# EAGLE design uLI-00 (EAGLE 7.2.0)
AUTHOR: M. Petrilak; VERSION: 00
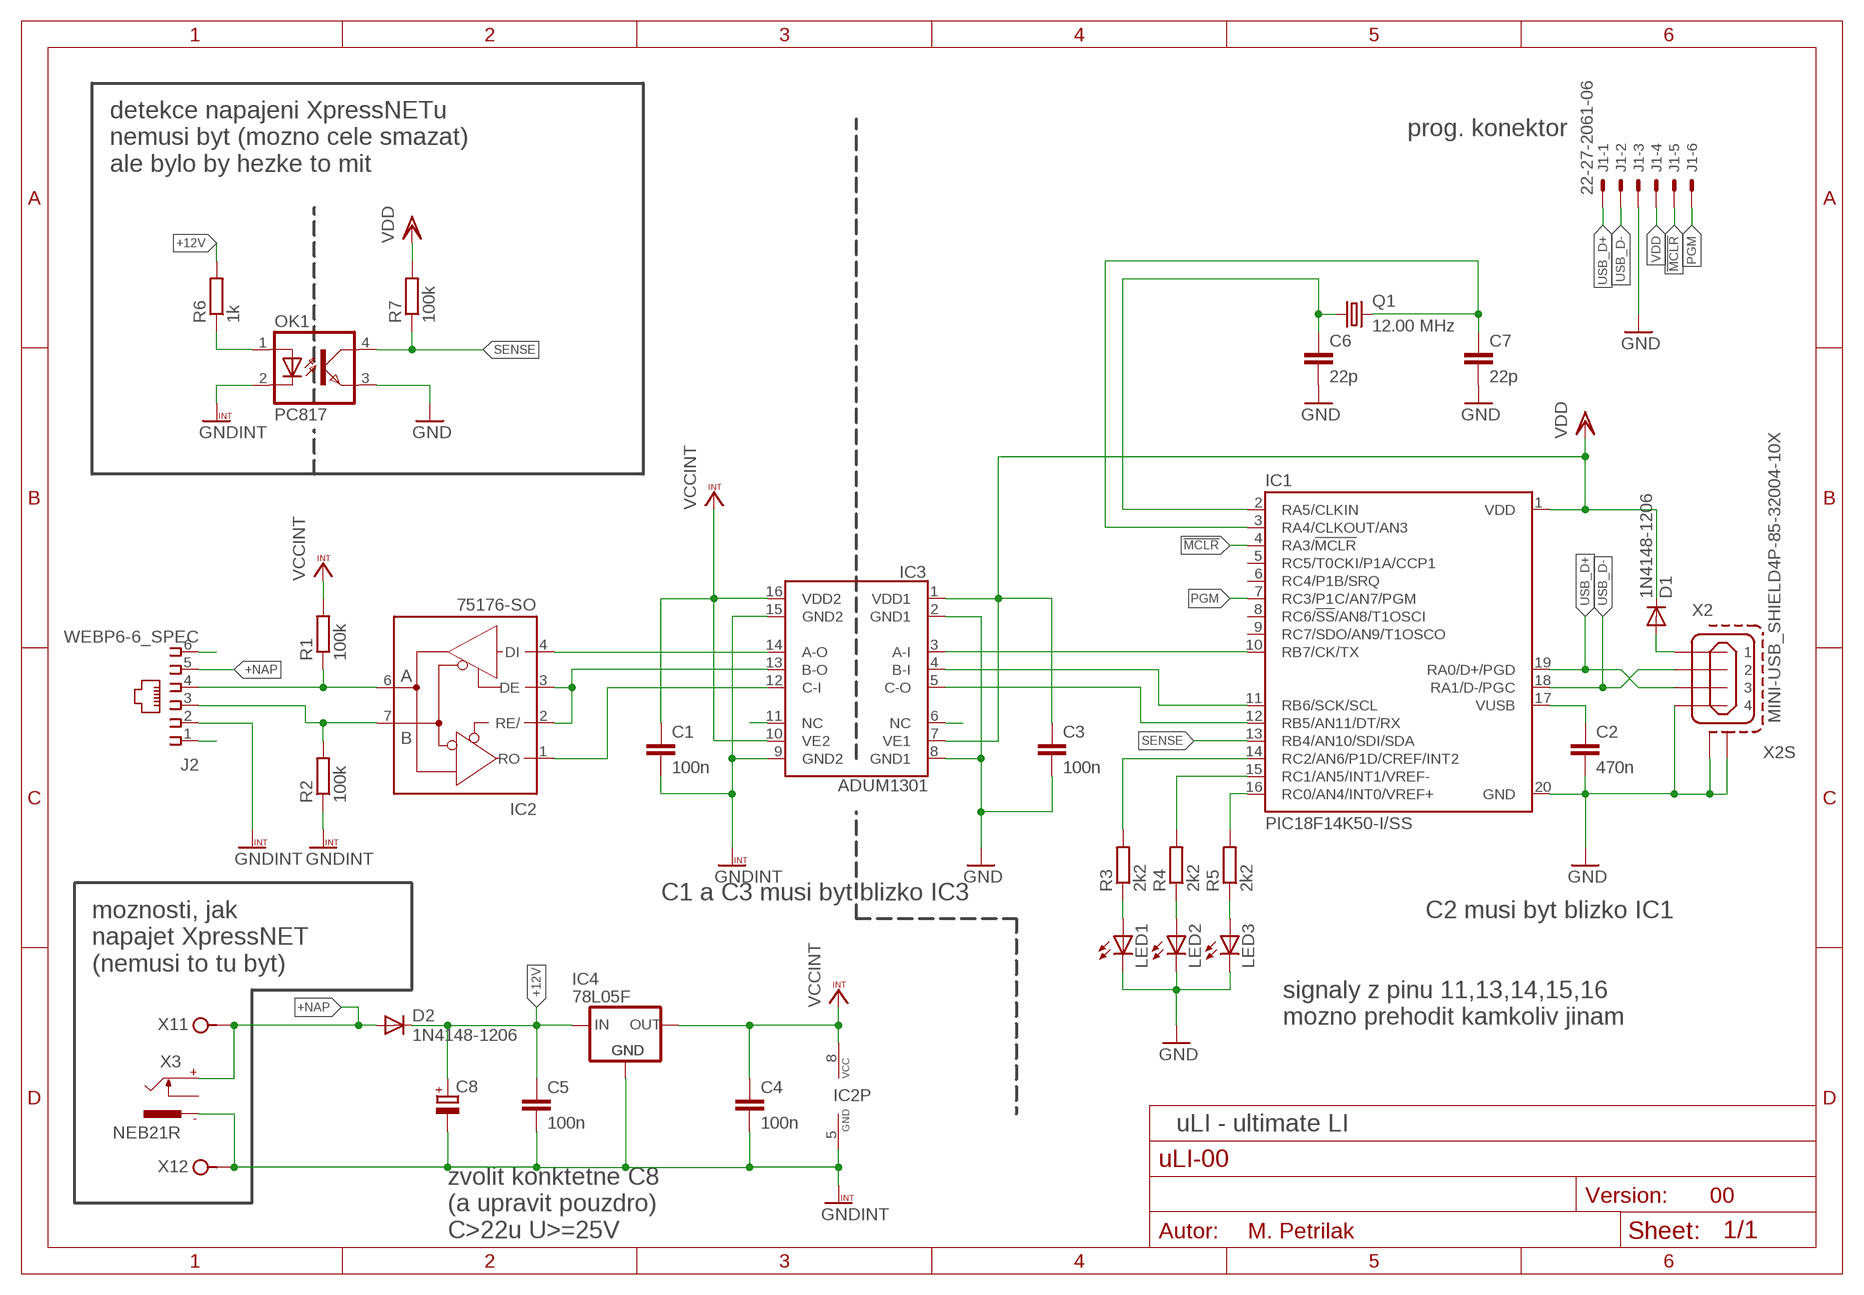
[diagram p0: schematic, sheet 1]

## Parts
C1  100n  C-EUC1206  [C1206]
C2  470n  C-EUC1206  [C1206]
C3  100n  C-EUC1206  [C1206]
C4  100n  C-EUC1206  [C1206]
C5  100n  C-EUC1206  [C1206]
C6  22p  C-EUC0805  [C0805]
C7  22p  C-EUC0805  [C0805]
C8  CPOL-EUE3.5-8L  [E3,5-8L]
D1  1N4148-1206  [D1206]
D2  1N4148-1206  [D1206]
IC1  PIC18F14K50-I/SS  [SSOP20]
IC2  75176-SO  [SO08]
IC3  ADUM1301  [SO-16W]
IC4  78L05F  [SOT89]
J1  22-27-2061-06  [6410-06]
J2  WEBP6-6_SPEC  [WEBP6-6_SPEC]
LED1  LED3MM  [LED3MM]
LED2  LED3MM  [LED3MM]
LED3  LED3MM  [LED3MM]
OK1  PC817  [DIL04]
Q1  12.00 MHz  XTAL  [HC49U70]
R1  100k  R-EU_R1206  [R1206]
R2  100k  R-EU_R1206  [R1206]
R3  2k2  R-EU_R1206  [R1206]
R4  2k2  R-EU_R1206  [R1206]
R5  2k2  R-EU_R1206  [R1206]
R6  1k  R-EU_R1206  [R1206]
R7  100k  R-EU_R1206  [R1206]
X1  ARK1550/2  [ARK1550/2]
X2  MINI-USB_SHIELD4P-85-32004-10X  [85-32004-10X]
X3  NEB21R  [NEB21R]

## Nets
!MCLR: IC1.4(RA3/!MCLR!) J1.5
+12V [BUS]: C5.1 C8.+ D2.C IC4.3(VI) R6.2
+NAP [BUS]: D2.A J2.5 X1.1 X3.+
BUS_A [BUS]: IC2.6(A) J2.4 R1.1
BUS_B [BUS]: IC2.7(B) J2.3 R2.2
GND: C2.2 C3.2 C6.2 C7.2 IC1.20(GND) IC3.2(GND1) IC3.8(GND1) J1.3 LED1.K(C) LED2.K(C) LED3.K(C) OK1.3(EMIT) X2.4 X2.M1(S1) X2.M2(S2)
GNDINT [BUS]: C1.2 C4.2 C5.2 C8.- IC2.5(GND) IC3.9(GND2) IC3.15(GND2) IC4.2(GND) IC4.2@1(GND) J2.2 OK1.2(C) R2.1 X1.2 X3.-
N$1: C2.1 IC1.17(VUSB)
N$2: LED1.A R3.1
N$3: LED2.A R4.1
N$4: IC1.12(RB5/AN11/DT/RX) IC3.5(C-O)
N$5: IC1.10(RB7/CK/TX) IC3.3(A-I)
N$6: IC1.11(RB6/SCK/SCL) IC3.4(B-I)
N$7 [BUS]: IC2.4(DI) IC3.14(A-O)
N$8: LED3.A R5.1
N$10: D1.A X2.1
N$11: IC1.14(RC2/AN6/P1D/CREF/INT2) R3.2
N$12: C7.1 IC1.3(RA4/CLKOUT/AN3) Q1.2
N$13 [BUS]: IC2.2(RE/) IC2.3(DE) IC3.13(B-O)
N$14 [BUS]: IC2.1(RO) IC3.12(C-I)
N$15: C6.1 IC1.2(RA5/CLKIN) Q1.1
N$16: IC1.15(RC1/AN5/INT1/VREF-) R4.2
N$17: IC1.16(RC0/AN4/INT0/VREF+) R5.2
N$19 [BUS]: J2.6
N$20 [BUS]: J2.1
N$21 [BUS]: IC3.11(NC)
N$22: IC3.6(NC)
N$23 [BUS]: OK1.1(A) R6.1
PGM: IC1.7(RC3/P1C/AN7/PGM) J1.6
SENSE: IC1.13(RB4/AN10/SDI/SDA) OK1.4(COL) R7.1
USB_D+: IC1.19(RA0/D+/PGD) J1.1 X2.3
USB_D-: IC1.18(RA1/D-/PGC) J1.2 X2.2
VCCINT [BUS]: C1.1 C4.1 IC2.8(VCC) IC3.10(VE2) IC3.16(VDD2) IC4.1(VO) R1.2
VDD: C3.1 D1.C IC1.1(VDD) IC3.1(VDD1) IC3.7(VE1) J1.4 R7.2
Unconnected: IC1.5(RC5/T0CKI/P1A/CCP1) IC1.6(RC4/P1B/SRQ) IC1.8(RC6/!SS!/AN8/T1OSCI) IC1.9(RC7/SDO/AN9/T1OSCO) X3.C

## Notes on the sheet
- detekce napajeni XpressNETu
  nemusi byt (mozno cele smazat)
  ale bylo by hezke to mit
- prog. konektor
- C1 a C3 musi byt blizko IC3
- C2 musi byt blizko IC1
- moznosti, jak
  napajet XpressNET
  (nemusi to tu byt)
- signaly z pinu 11,13,14,15,16
  mozno prehodit kamkoliv jinam
- uLI - ultimate LI
- zvolit konktetne C8
  (a upravit pouzdro)
  C>22u U>=25V

## Library data of the parts
C1-C7 = rcl:C-EU: CAPACITOR, European symbol
C8 = rcl:CPOL-EU: POLARIZED CAPACITOR, European symbol
D1 D2 = diode:1N4148: DIODE high speed (Philips)
IC1 = microchip:PIC18*K50: PIC with USB
IC2 = maxim:75176
IC3 = my:ADUM1301
IC4 = linear:78L*: POSITOIV-VOLTAGE REGULATORS Output up to 100 mA Source: http://focus.ti.com/lit/ds/symlink/ua78l05.pdf
J1 = con-molex:22-?-06: CONNECTOR wire to board 2.54 mm (.1 inch) pitch header
J2 = con-malina:WEBP6-6
LED1-LED3 = led:LED: LED OSRAM: - CHIPLED LG R971, LG N971, LY N971, LG Q971, LY Q971, LO R971, LY R971 LH N974, LH R974 LS Q976, LO Q976, LY Q976 LO Q996 - Hyper CHIPLED LW Q18S LB Q993, LB Q99A, LB R99A - SideLED LS A670, LO A670, LY A670, LG A670, LP A670 LB A673, LV A673, LT A673, LW A673 LH A674 LY A675 LS A676, LA A676, LO A676, LY A676, LW A676 LS A679, LY A679, LG A679 - Hyper Micro SIDELED® LS Y876, LA Y876, LO Y876, LY Y876 LT Y87S - SmartLED LW L88C, LW L88S LB L89C, LB L89S, LG L890 LS L89K, LO L89K, LY L89K LS L896, LA L896, LO L896, LY L896 - TOPLED LS T670, LO T670, LY T670, LG T670, LP T670 LSG T670, LSP T670, LSY T670, LOP T670, LYG T670 LG T671, LOG T671, LSG T671 LB T673, LV T673, LT T673, LW T673 LH T674 LS T676, LA T676, LO T676, LY T676, LB T676, LH T676, LSB T676, LW T676 LB T67C, LV T67C, LT T67C, LS T67K, LO T67K, LY T67K, LW E67C LS E67B, LA E67B, LO E67B, LY E67B, LB E67C, LV E67C, LT E67C LW T67C LS T679, LY T679, LG T679 LS T770, LO T770, LY T770, LG T770, LP T770 LB T773, LV T773, LT T773, LW T773 LH T774 LS E675, LA E675, LY E675, LS T675 LS T776, LA T776, LO T776, LY T776, LB T776 LHGB T686 LT T68C, LB T68C - Hyper Mini TOPLED® LB M676 - Mini TOPLED Santana® LG M470 LS M47K, LO M47K, LY M47K Source: http://www.osram.convergy.de LUXEON: - LUMILED® LXK2-PW12-R00, LXK2-PW12-S00, LXK2-PW14-U00, LXK2-PW14-V00 LXK2-PM12-R00, LXK2-PM12-S00, LXK2-PM14-U00 LXK2-PE12-Q00, LXK2-PE12-R00, LXK2-PE12-S00, LXK2-PE14-T00, LXK2-PE14-U00 LXK2-PB12-K00, LXK2-PB12-L00, LXK2-PB12-M00, LXK2-PB14-N00, LXK2-PB14-P00, LXK2-PB14-Q00 LXK2-PR12-L00, LXK2-PR12-M00, LXK2-PR14-Q00, LXK2-PR14-R00 LXK2-PD12-Q00, LXK2-PD12-R00, LXK2-PD12-S00 LXK2-PH12-R00, LXK2-PH12-S00 LXK2-PL12-P00, LXK2-PL12-Q00, LXK2-PL12-R00 Source: www.luxeon.com KINGBRIGHT: KA-3528ASYC Source: www.kingbright.com
OK1 = optocoupler:PC817: SHARP OPTO COUPLER
Q1 = crystal:XTAL
R1-R7 = rcl:R-EU_: RESISTOR, European symbol
X1 = con-malina:ARK1550/2
X2 = con-cypressindustries:MINI-USB_SHIELD4P-: MINI USB 4 Pol. Source: www.cypressindustries.com
X3 = con-lumberg:NEB21R: Klinkeneinbaukupplung

## Net classes
0 default: width 0.3 mm
1 BUS: clearance 3 mm to class 0

## Board
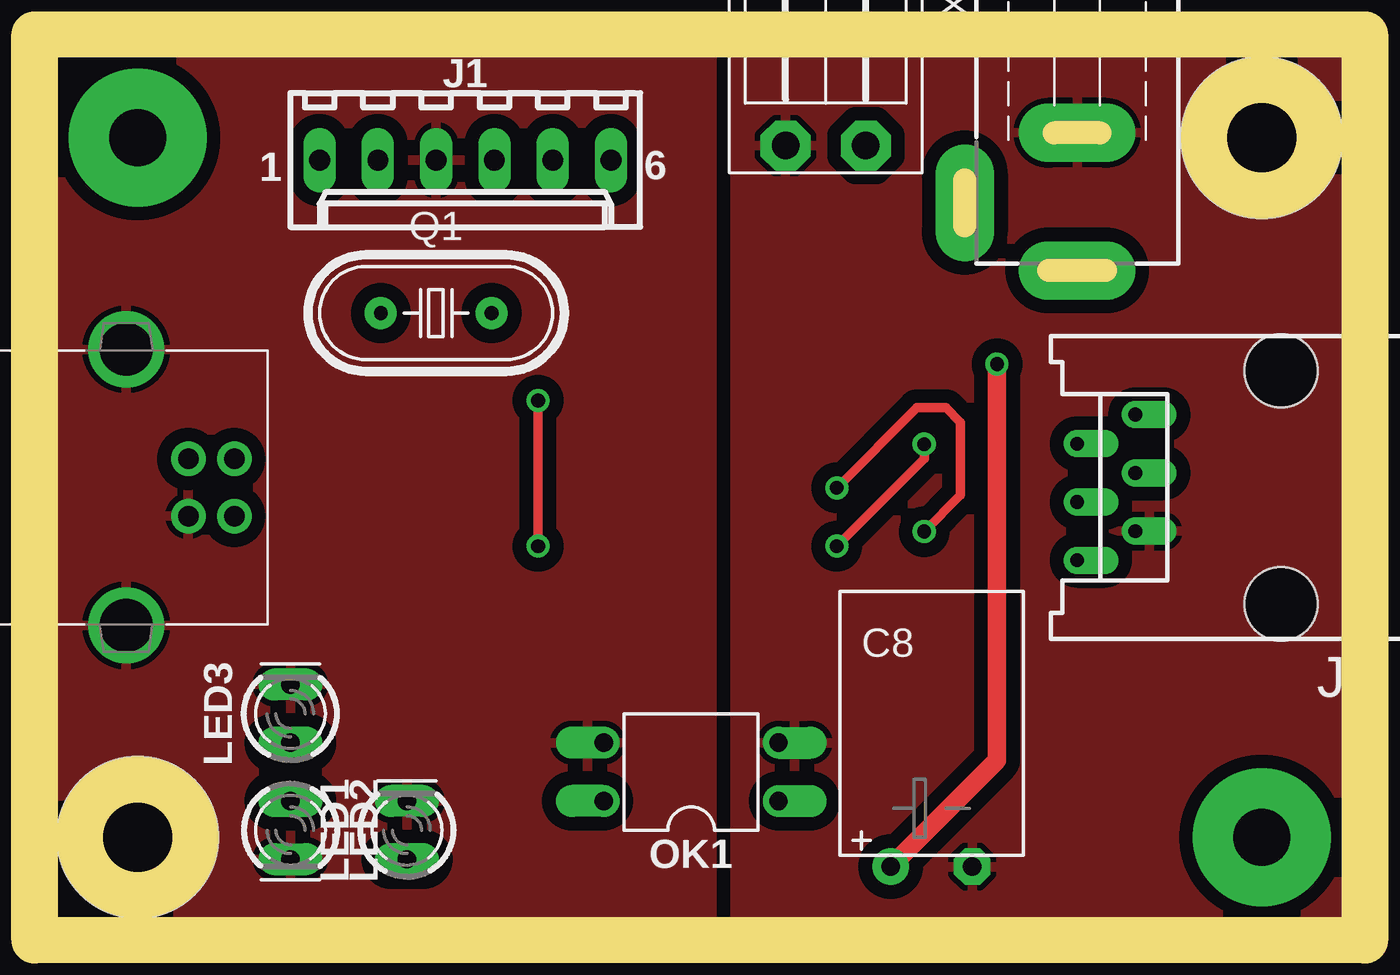
[diagram p1: board, top side]
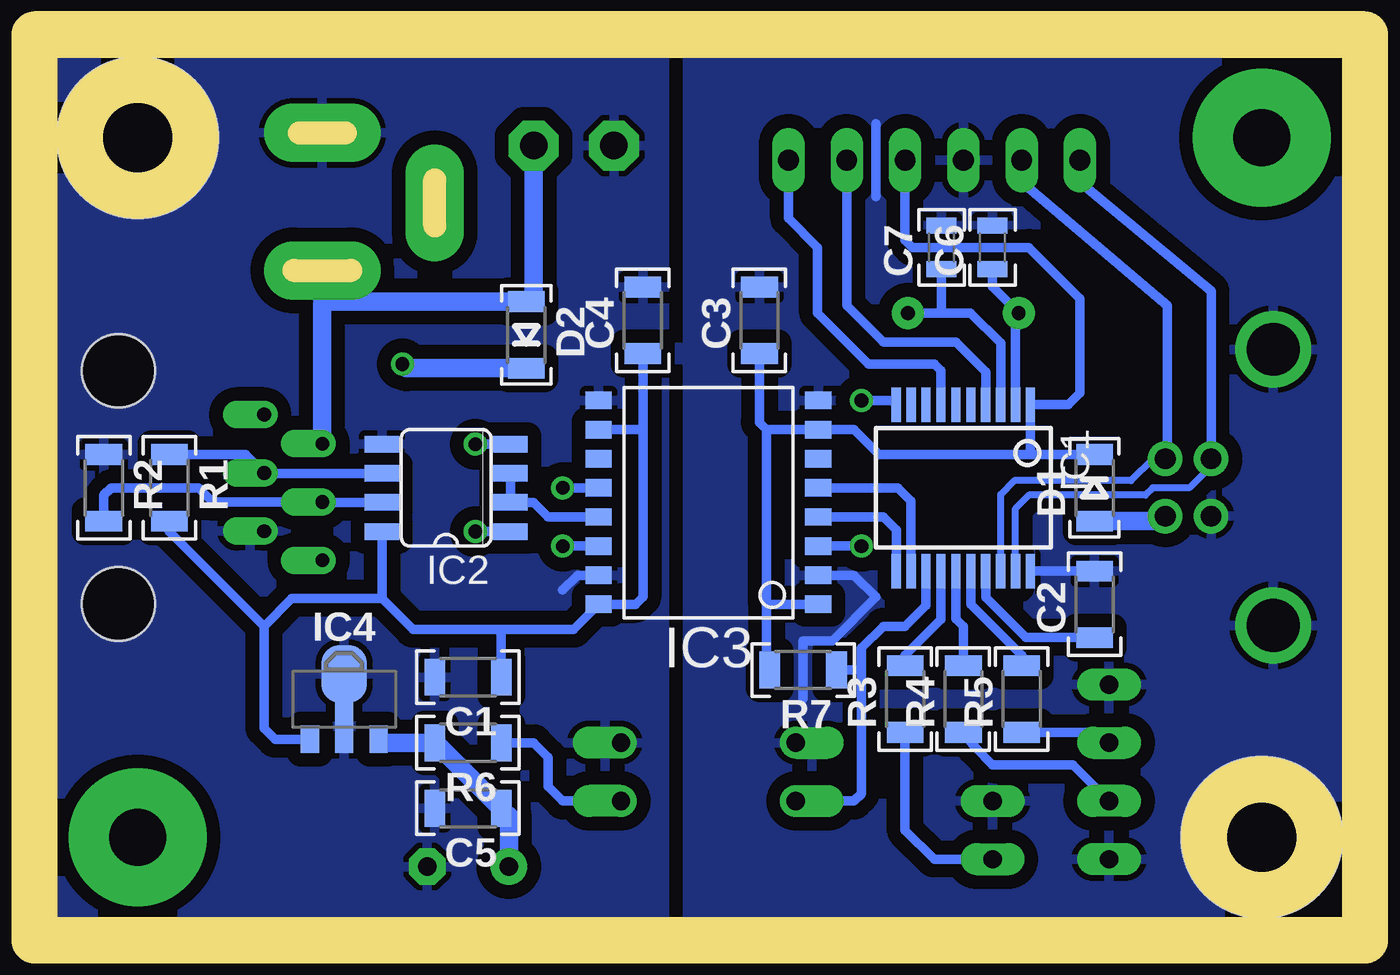
[diagram p2: board, bottom side, seen from below]

Size 56 x 37.5 mm. Coordinates in mm from the lower left corner, seen from the top.
Outline: 0,0 56,0 56,37.5 0,37.5 0,0
Copper layers (1*16): Top 0.035mm / dielectric 1.5mm / Bottom 0.035mm
Design rules "default": minimum track width 0.3mm, minimum drill 0.6mm, track to track 0.6mm, track to pad 0.6mm, pad to pad 0.5mm, via to via 1mm, smd to smd 8mil, copper to edge 1mil, drill to drill 8mil, minimum pad ring 10mil, minimum via ring 8mil, stop-mask expansion 4mil, vias tented up to drill 0mil, thermal gap 10mil
Holes 7 mm at 3.5,3.5 52.5,34
Milling: area 1,1 to 6,6; area 50,31.5 to 55,36.5; 4 lines

### Footprints (pad centres in the part's own frame; a part is rotated, then mirrored left to right if it is on the bottom)
C1206 = smd 0.9 x 1.6: 1 -1.45,0; 2 1.45,0
C0805 = smd 0.7 x 1.3: 1 -0.95,0; 2 0.95,0
E3,5-8L = drill 0.813 pad 1.6: + -1.778,0 | drill 0.813 pad 1.6 octagon: - 1.778,0
D1206 = smd 0.9 x 1.6: A -1.45,0; C 1.45,0
SSOP20 = smd 0.4 x 1.5: 1 -2.925,-3.625; 2 -2.275,-3.625; 3 -1.625,-3.625; 4 -0.975,-3.625; 5 -0.325,-3.625; 6 0.325,-3.625; 7 0.975,-3.625; 8 1.625,-3.625; 9 2.275,-3.625; 10 2.925,-3.625; 11 2.925,3.625; 12 2.275,3.625; 13 1.625,3.625; 14 0.975,3.625; 15 0.325,3.625; 16 -0.325,3.625; 17 -0.975,3.625; 18 -1.625,3.625; 19 -2.275,3.625; 20 -2.925,3.625
SO08 = smd 0.72 x 1.5: 1 -1.905,-2.8; 2 -0.635,-2.8; 3 0.635,-2.8; 4 1.905,-2.8; 5 1.905,2.8; 6 0.635,2.8; 7 -0.635,2.8; 8 -1.905,2.8
SO-16W = smd 0.762 x 1.143: 1 -5.08,-4.788; 2 -3.81,-4.788; 3 -2.54,-4.788; 4 -1.27,-4.788; 5 0,-4.788; 6 1.27,-4.788; 7 2.54,-4.788; 8 3.81,-4.788; 9 3.81,4.788; 10 2.54,4.788; 11 1.27,4.788; 12 0,4.788; 13 -1.27,4.788; 14 -2.54,4.788; 15 -3.81,4.788; 16 -5.08,4.788
SOT89 = smd 0.8 x 1.2: 1 -1.5,-1.75; 3 1.499,-1.75 | smd 0.8 x 2.3: 2 0,-1.2 | smd 2 x 2.5: 2@1 0,1.1
6410-06 = drill 0.9 long: 1 6.35,0; 2 3.81,0; 3 1.27,0; 4 -1.27,0; 5 -3.81,0; 6 -6.35,0
WEBP6-6_SPEC = drill 0.6 pad 1.2 offset: 1 -3.175,8.89; 2 -1.905,6.35; 3 -0.635,8.89; 4 0.635,6.35; 5 1.905,8.89; 6 3.175,6.35 | hole 3.2: -5.08,0; 5.08,0
LED3MM = drill 0.8 pad 1.4 long: A -1.27,0; K 1.27,0
DIL04 = drill 0.8 pad 1.4 offset: 1 -1.27,-3.81; 2 1.27,-3.81; 3 1.27,3.81; 4 -1.27,3.81
HC49U70 = drill 0.6 pad 1.4: 1 -2.413,0; 2 2.413,0
R1206 = smd 0.9 x 1.6: 1 -1.45,0; 2 1.45,0
ARK1550/2 = drill 1.2 pad 2.184 octagon: 1 0,0; 2 3.5,0
85-32004-10X = drill 0.9 pad 1.5: 1 4.71,-1.25; 2 4.71,1.25; 3 2.71,1.25; 4 2.71,-1.25 | drill 2.3 pad 3: M1 0,6.02; M2 0,-6.02
NEB21R = drill 0.813 pad 2.54 long: + 0,7.35; - 0,1.35; C 4.9,4.4 | hole 0.8: -1.25,7.35; 1.25,7.35; -1,1.35; 1,1.35; 4.9,3.4; 4.9,5.4

### Placement (x,y rotation side)
C1  38.1,10.48 180 bottom
C2  10.79,13.65 90 bottom
C3  25.4,26.04 90 bottom
C4  30.48,26.04 90 bottom
C5  38.1,4.76 180 bottom
C6  15.24,29.21 90 bottom
C7  17.46,29.21 90 bottom
C8  38.1,2.22 0 top
D1  10.79,18.73 90 bottom
D2  35.56,25.4 270 bottom
IC1  16.51,18.73 180 bottom
IC2  39.05,18.73 90 bottom
IC3  27.62,18.73 90 bottom
IC4  43.5,9.53 0 bottom
J1  17.78,33.02 180 top
J2  53.34,18.75 90 top
LED1  15.24,3.81 90 top
LED2  10.16,3.81 270 top
LED3  10.16,8.89 90 top
OK1  27.62,6.35 90 top
Q1  16.51,26.35 0 top
R1  51.12,18.73 270 bottom
R2  53.98,18.73 270 bottom
R3  19.05,9.53 90 bottom
R4  16.51,9.53 90 bottom
R5  13.97,9.53 90 bottom
R6  38.1,7.62 180 bottom
R7  23.5,10.79 180 bottom
X1  35.24,33.66 180 top
X2  3,18.75 0 top
X3  44.45,35.56 180 top

### Tracks (layer width: path | path; a pad name or v marks a point on that pad's centre or on a via)
!MCLR
  Bottom 0.406: IC1.4 15.54,23.79 16.83,25.08 20,25.08 21.59,26.67 J1.5
+12V  (via drill 0.6)
  Top 0.813: v40.96,24.13 40.96,6.86 C8.+
  Bottom 0.406: 36.32,4.43 C5.1 | R6.2 39.51,7.62 | 41.84,7.62 IC4.3
  Bottom 0.813: C8.+ 36.32,4.43 | 39.51,7.62 C5.1 | R6.2 41.84,7.62 | D2.C 40.78,23.95 v40.96,24.13
+NAP
  Bottom 0.813: X1.1 35.24,27.17 D2.A 44.31,26.85 | X3.+ 44.45,26.99 44.31,26.85 | J2.5 44.45,26.71 44.31,26.85
BUS_A
  Bottom 0.406: R1.1 47.79,20.18 J2.4 46.97,19.37 IC2.6
BUS_B
  Bottom 0.406: R2.2 53.98,18.41 53.66,18.73 49.85,18.73 49.23,18.11 J2.3 44.43,18.1 IC2.7
GND
  Bottom 0.406: C2.2 IC1.20 | 23.5,9.53 23.5,12.06 22.23,12.06 20.32,13.97 21.27,14.92 IC3.2 | 20.32,34.61 20.32,31.43
  pour Top (rank 6): 0,0 56,0 56,37.5 0,37.5
  pour Bottom (rank 6): 0,0 56,0 56,37.5 0,37.5
GNDINT
  Bottom 0.406: 32.38,14.92 33.34,14.92 33.97,14.29
  pour Top (rank 2): 29.53,37.5 56,37.5 56,0 29.53,0
  pour Bottom (rank 2): 29.53,37.5 56,37.5 56,0 29.53,0
N$1
  Bottom 0.406: IC1.17 15.54,13.95 13.79,12.2 C2.1
N$2
  Bottom 0.406: LED1.A 17.78,2.54 19.05,3.81 R3.1
N$3
  Bottom 0.406: R4.1 16.01,7.44 15.24,6.67 11.75,6.67 LED2.A
N$4
  Bottom 0.406: IC3.5 19.37,18.73 18.79,18.15 IC1.12
N$5  (via drill 0.6)
  Top 0.406: v20.95,16.19 v20.95,22.54
  Bottom 0.406: IC3.3 v20.95,16.19 | v20.95,22.54 19.62,22.54 IC1.10
N$6
  Bottom 0.406: IC3.4 20,17.46 19.43,16.89 IC1.11
N$7  (via drill 0.6)
  Top 0.406: v37.78,20.64 37.78,20 v33.97,16.19
  Bottom 0.406: IC3.14 v33.97,16.19 | v37.78,20.64 IC2.4
N$8
  Bottom 0.406: R5.1 10.62,8.07 LED3.A
N$9  (via drill 2.5 pad 6)
  other vias: 3.5,34
N$10
  Bottom 0.813: D1.A 7.93,17.28 X2.1
N$11
  Bottom 0.406: IC1.14 17.48,12.99 19.05,11.43 R3.2
N$12
  Bottom 0.406: IC1.3 14.88,25.05 16.19,26.35 17.46,26.35 | 17.46,26.35 Q1.2 | C7.1 17.46,26.35
N$13
  Bottom 0.406: IC2.3 IC2.2 35.24,18.1 34.61,17.46 IC3.13
N$14  (via drill 0.6)
  Top 0.406: v33.97,18.73 37.47,22.23 38.73,22.23 39.37,21.59 39.37,18.41 v37.78,16.83
  Bottom 0.406: IC3.12 v33.97,18.73 | v37.78,16.83 IC2.1
N$15
  Bottom 0.406: IC1.2 14.23,26.21 Q1.1 15.24,27.5 C6.1
N$16
  Bottom 0.406: IC1.15 16.84,13.03 16.51,12.7 R4.2
N$17
  Bottom 0.406: IC1.16 16.18,13.64 13.97,11.43 R5.2
N$18  (via drill 2.5 pad 6)
  other vias: 52.5,3.5
N$23
  Bottom 0.406: R6.1 35.24,7.62 34.61,6.99 34.61,5.71 33.97,5.08 OK1.1
PGM
  Bottom 0.406: IC1.7 17.48,23.84 17.78,24.13 20.64,24.13 22.86,26.35 22.86,29.21 24.13,30.48 J1.6
SENSE
  Bottom 0.406: IC1.13 18.14,13.62 19.05,12.7 20,12.7 20.95,11.75 20.95,10.79 | OK1.4 21.27,5.08 20.95,5.4 20.95,10.79 | R7.1 20.95,10.79
USB_D+
  Bottom 0.305: X2.3 5.71,19.69 6.67,18.73 8.26,18.73 8.57,18.41 13.65,18.41 14.23,17.83 IC1.19
  Bottom 0.406: J1.1 11.43,32.07 5.71,27.3 X2.3
USB_D-
  Bottom 0.305: IC1.18 14.88,18.45 14.29,19.05 9.21,19.05 8.26,20 X2.2
  Bottom 0.406: J1.2 13.97,32.07 7.62,26.67 7.62,20.09 X2.2
VCCINT
  Bottom 0.406: IC3.10 30.48,21.27 | C4.1 30.48,21.27 | 30.48,21.27 30.48,13.97 30.8,13.65 IC3.16 33.5,12.56 36.83,12.56 | IC4.1 46.51,7.78 46.99,8.26 46.99,12.7 | IC2.8 41.85,13.91 | R1.2 51.12,16.83 46.99,12.7 | 41.85,13.91 45.78,13.91 46.99,12.7 | 41.85,13.91 40.5,12.56 36.83,12.56 | C1.1 36.65,12.38 36.83,12.56
VDD
  Bottom 0.406: 25.08,13.65 25.08,21.27 | D1.C 13.65,20.18 | 13.65,20.18 20.18,20.18 21.27,21.27 IC3.7 25.08,21.27 | 13.65,20.18 13.59,20.25 IC1.1 11.93,22.36 11.43,22.86 11.43,26.99 13.65,29.21 18.73,29.21 19.05,29.53 J1.4 | IC3.1 25.08,13.65 | 25.08,13.65 25.08,10.3 R7.2 | C3.1 25.4,21.59 25.08,21.27